# EAGLE design MAX30101_Qwiic_PCB_v6 (EAGLE 9.6.2)
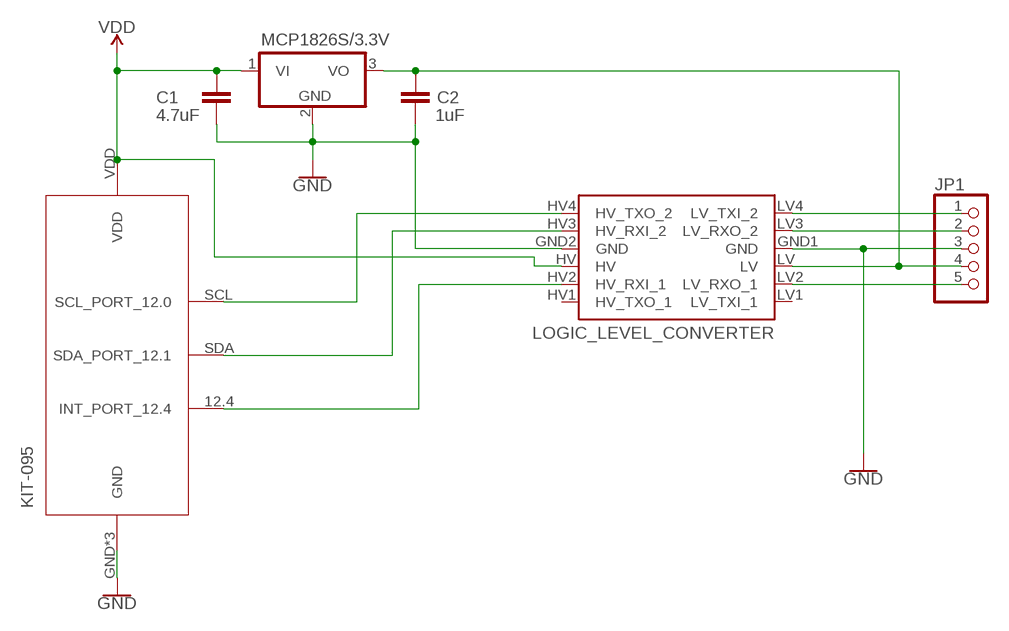
[diagram p0: schematic, sheet 1]

## Parts
C1  4.7uF  0.1UF-KIT-EZ-50V-20%  [CAP-PTH-SMALL-KIT]
C2  1uF  0.1UF-KIT-EZ-50V-20%  [CAP-PTH-SMALL-KIT]
IC1  7805T  [TO220H]
JP1  PINHD-1X5/90  [1X05/90]
KIT-095  KIT-095  [KIT-095]
LOGIC_LEVEL_CONVERTER  SPARKFUN_LOGIC_LEVEL_CONVERTER  [SPARKFUN_LOGIC_LEVEL_CONVERTER]

## Nets
GND [power]: C1.2 C2.2 IC1.2(GND) JP1.3 KIT-095._GND(GND) KIT-095.GND KIT-095.GND_(GND) LOGIC_LEVEL_CONVERTER.GND1(GND) LOGIC_LEVEL_CONVERTER.GND2(GND)
N$1: C2.1 IC1.3(VO) JP1.4 LOGIC_LEVEL_CONVERTER.LV
N$2: KIT-095.SCL(SCL_PORT_12.0) LOGIC_LEVEL_CONVERTER.HV4(HV_TXO_2)
N$4: KIT-095.SDA(SDA_PORT_12.1) LOGIC_LEVEL_CONVERTER.HV3(HV_RXI_2)
N$5: KIT-095.12.4(INT_PORT_12.4) LOGIC_LEVEL_CONVERTER.HV2(HV_RXI_1)
N$6: JP1.1 LOGIC_LEVEL_CONVERTER.LV4(LV_TXI_2)
N$7: JP1.2 LOGIC_LEVEL_CONVERTER.LV3(LV_RXO_2)
N$8: JP1.5 LOGIC_LEVEL_CONVERTER.LV2(LV_RXO_1)
VDD: C1.1 IC1.1(VI) KIT-095.VDD LOGIC_LEVEL_CONVERTER.HV
Unconnected: LOGIC_LEVEL_CONVERTER.HV1(HV_TXO_1) LOGIC_LEVEL_CONVERTER.LV1(LV_TXI_1)

## Notes on the sheet
- MCP1826S/3.3V

## Library data of the parts
C1 C2 = SparkFun-Capacitors:0.1UF: 0.1µF ceramic capacitors A capacitor is a passive two-terminal electrical component used to store electrical energy temporarily in an electric field.; PROD_ID: CAP-08370; VALUE: 0.1uF
IC1 = linear:78*: Positive VOLTAGE REGULATOR Source: http://cache.national.com/ds/LM/LM78L05.pdf http://www.fairchildsemi.com/ds/LM/LM7805.pdf
JP1 = pinhead:PINHD-1X5: PIN HEADER
KIT-095 = Support-Library:KIT-095
LOGIC_LEVEL_CONVERTER = SparkFun-Boards:SPARKFUN_LOGIC_LEVEL_CONVERTER: SparkFun Logic Level Converter -Bi-Directional This is the mechnical outline for the 3.3V - 5V bi directional logic level converter. *Note, the "LOCK" Package has the header pins staggered by an offset of 5 mils (off center line), so that when you slide a row of standard 0.1" headers into the PTH pads, it will hold position vertically. See the follwing turorial for more information on this type of special footprints: Sneaky Footprints <https://www.sparkfun.com/tutorials/114> SparkFun Products: SparkFun Logic Level Converter - Bi-Directional <https://www.sparkfun.com/products/12009>

## Net classes
0 default: width 1 mm, drill 0.8 mm, clearance 0.6 mm
1 power: width 1 mm, drill 0.8 mm, clearance 0.205 mm to class 0, clearance 0.6 mm

## Board
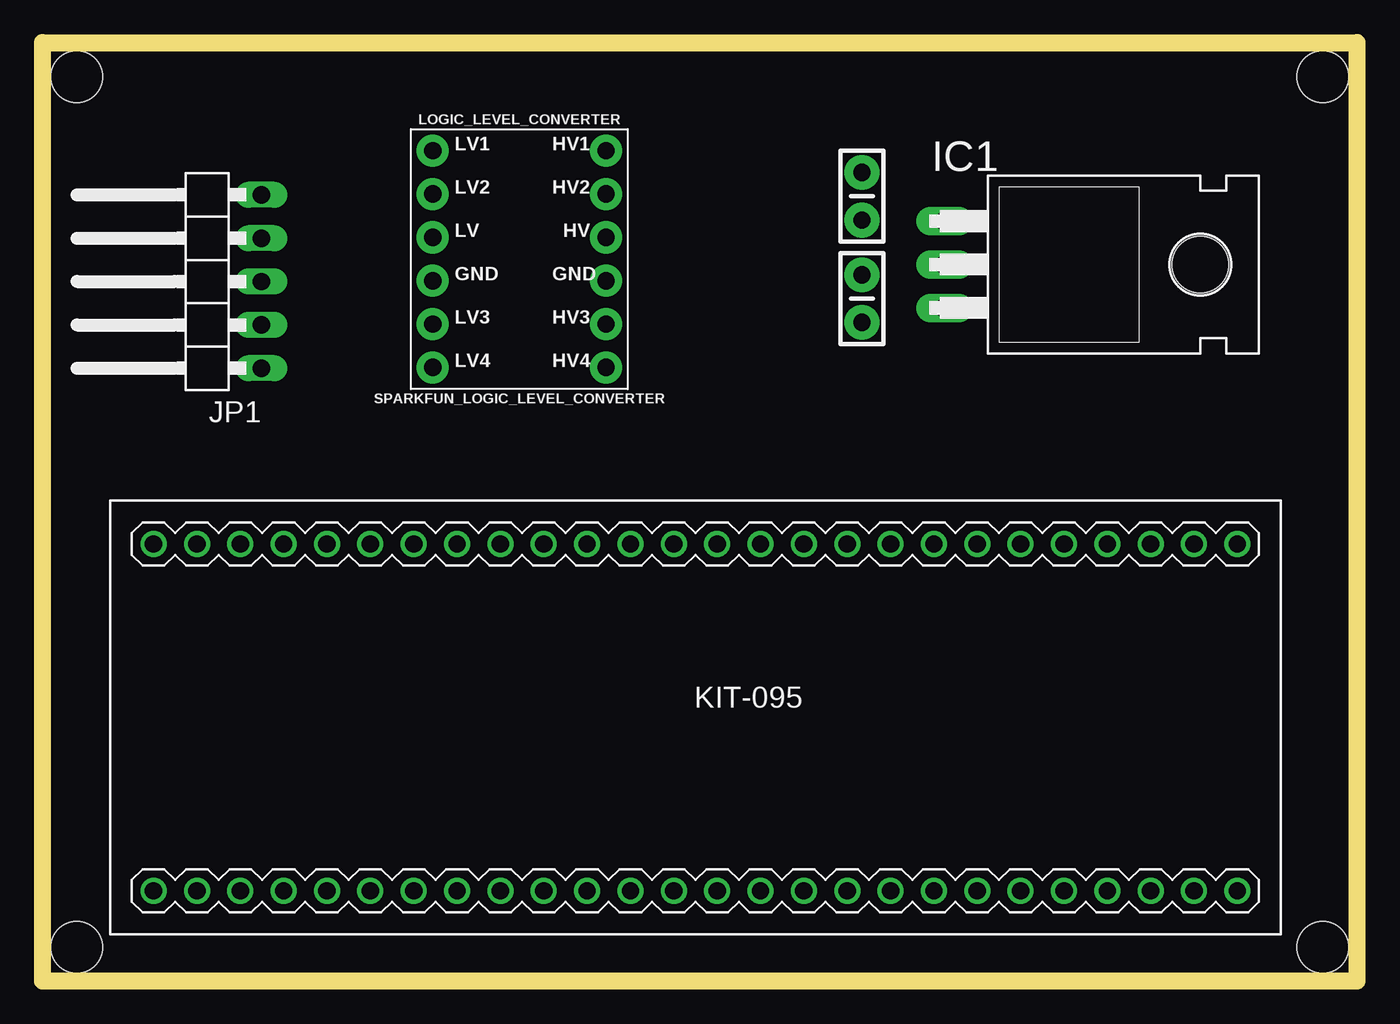
[diagram p1: board, top side]
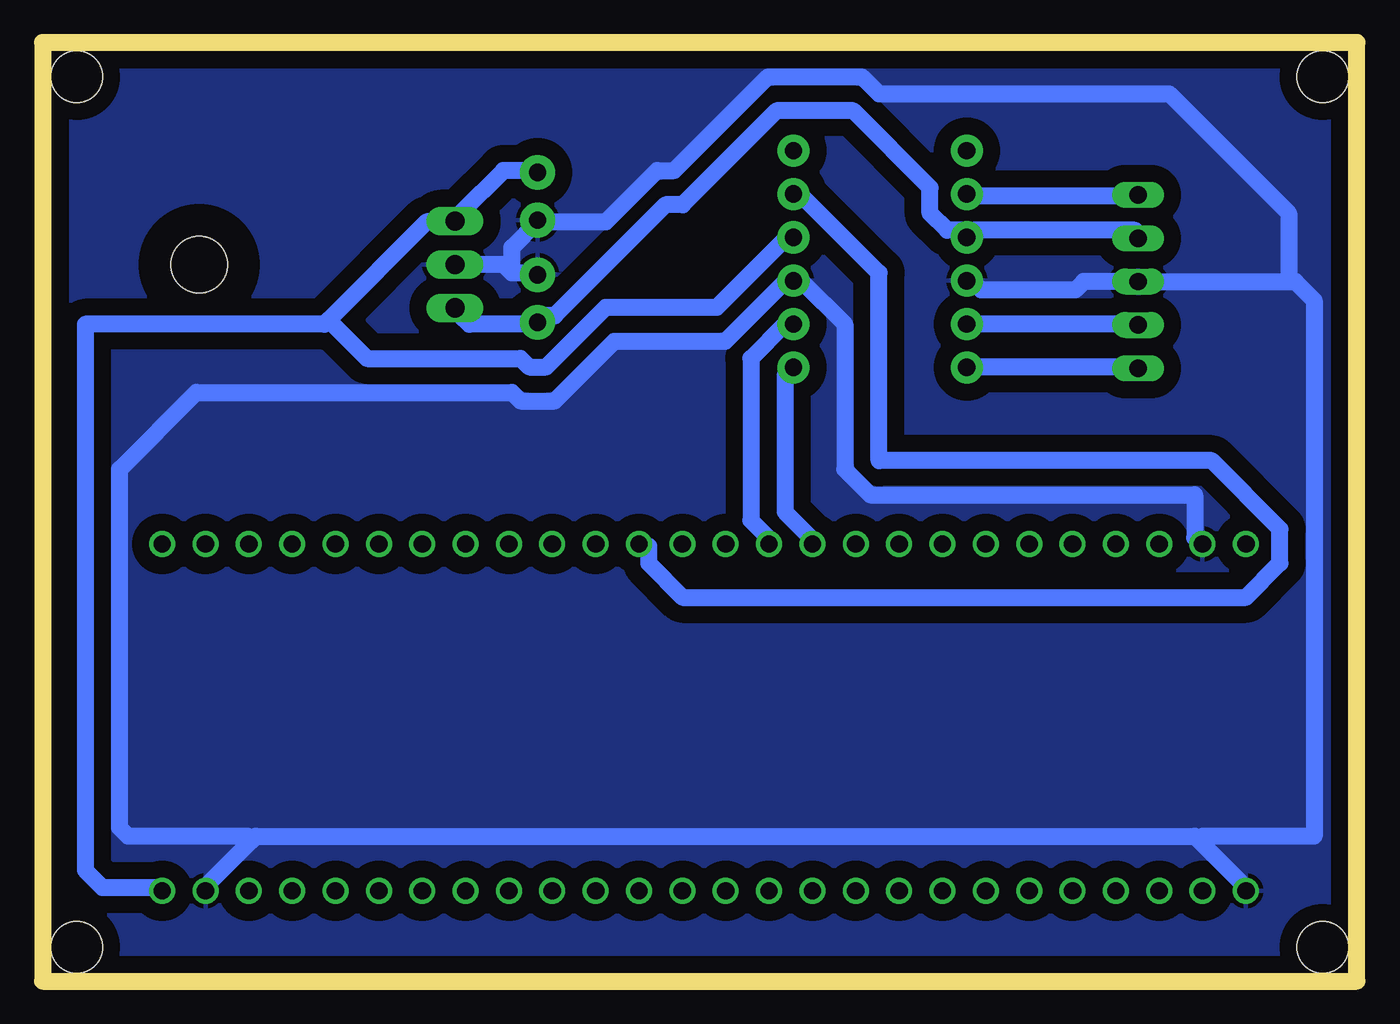
[diagram p2: board, bottom side, seen from below]

Size 77 x 55 mm. Coordinates in mm from the lower left corner, seen from the top.
Outline: 0,0 0,55 77,55 77,0 0,0
Copper layers (1*16): Top 0.035mm / dielectric 1.5mm / Bottom 0.035mm
Design rules "SparkFun-2-layer-TIGHT": minimum track width 7mil, minimum drill 15mil, track to track 7mil, track to pad 7mil, pad to pad 7mil, via to via 7mil, smd to smd 7mil, copper to edge 7mil, drill to drill 7mil, minimum pad ring 7mil, minimum via ring 7mil, stop-mask expansion 4mil, vias tented up to drill 25mil, thermal gap 10mil
Holes 3 mm at 2,53 2,2 75,2 75,53

### Footprints (pad centres in the part's own frame; a part is rotated, then mirrored left to right if it is on the bottom)
CAP-PTH-SMALL-KIT = drill 1.016 pad 2.032: 1 -1.397,0; 2 1.397,0
TO220H = drill 1.118 long: 1 -2.54,-10.16; 2 0,-10.16; 3 2.54,-10.16 | hole 3.302: 0,4.826
1X05/90 = drill 1.016 long: 1 -5.08,-3.81; 2 -2.54,-3.81; 3 0,-3.81; 4 2.54,-3.81; 5 5.08,-3.81
KIT-095 = drill 1.016: 0.0 7.62,0; 0.1 10.16,0; 0.2 12.7,0; 0.3 15.24,0; 0.4 17.78,0; 0.5 20.32,0; 0.6 22.86,0; 0.7 25.4,0; 1.0 -7.62,20.32; 1.1 -10.16,20.32; 1.2 -12.7,20.32; 1.3 -15.24,20.32; 1.4 -17.78,20.32; 1.5 -20.32,20.32; 1.6 -22.86,20.32; 1.7 -25.4,20.32; 2.0 33.02,20.32; 2.1 30.48,20.32; 2.2 27.94,20.32; 2.3 25.4,20.32; 2.4 22.86,20.32; 2.5 20.32,20.32; 2.6 17.78,20.32; 2.7 15.24,20.32; 3.0 -27.94,0; 3.1 -25.4,0; 3.2 -22.86,0; 3.3 -20.32,0; 3.4 -17.78,0; 3.5 -15.24,0; 3.6 -12.7,0; 3.7 -10.16,0; 12.2 0,20.32; 12.3 2.54,20.32; 12.4 5.08,20.32; 12.5 7.62,20.32; 15.0 -7.62,0; 15.1 -5.08,0; 15.2 -2.54,0; 15.3 0,0; 15.4 2.54,0; 15.5 5.08,0; _GND -30.48,0; GND -27.94,20.32; GND_ 30.48,0; RST 27.94,0; RX 10.16,20.32; SCL -5.08,20.32; SDA -2.54,20.32; TX 12.7,20.32; VDD 33.02,0; VDDIO -30.48,20.32
SPARKFUN_LOGIC_LEVEL_CONVERTER = drill 1.016 pad 1.88: GND1 -5.08,-1.27; GND2 5.08,-1.27; HV 5.08,1.27; HV1 5.08,6.35; HV2 5.08,3.81; HV3 5.08,-3.81; HV4 5.08,-6.35; LV -5.08,1.27; LV1 -5.08,6.35; LV2 -5.08,3.81; LV3 -5.08,-3.81; LV4 -5.08,-6.35

### Placement (x,y rotation side)
C1  48,46 270 top
C2  48,40 90 top
IC1  63,42 270 top
JP1  9,41 90 top
KIT-095  36.98,5.3 0 top
LOGIC_LEVEL_CONVERTER  27.93,42.32 0 top

### Tracks (layer width: path | path; a pad name or v marks a point on that pad's centre or on a via)
GND
  Bottom 1: LOGIC_LEVEL_CONVERTER.GND1 22.5,41 22,40.5 16.5,40.5 16,41 JP1.3 4,41 | IC1.2 50,42 49.75,41.75 | 49.75,41.75 49.5,41.5 48,41.5 C2.2 | 48,44.5 49.5,43 49.5,42 49.75,41.75 | 48,44.5 44,44.5 41,47.5 40,47.5 34.5,53 29,53 28,52 11,52 4,45 4,41 | 48,44.5 C1.2 | KIT-095.GND 9.5,26 9.5,28.5 28.5,28.5 30,30 30,38.5 32.5,41 33,41 LOGIC_LEVEL_CONVERTER.GND2 33.5,41 37,37.5 43.5,37.5 47,34 49,34 49.5,34.5 68,34.5 72.5,30 72.5,9 72,8.5 65,8.5 64.75,8.25 | 9.25,8.25 9.5,8.5 64.5,8.5 64.75,8.25 | 9.25,8.25 6.5,5.5 KIT-095._GND | 64.75,8.25 67.5,5.5 KIT-095.GND_ | 9.25,8.25 9,8.5 2.5,8.5 2.5,39.9 3.6,41 4,41
  pour Bottom (isolate 1): 1,54 1,1 76,1 76,54
N$1
  Bottom 1: IC1.3 52.5,39 52,38.5 48,38.5 C2.1 48,39 47,39 40.5,45.5 39.5,45.5 34,51 29.5,51 25,46.5 25,45 24,44 23,44 LOGIC_LEVEL_CONVERTER.LV 22.5,44 13,44 JP1.4
N$2
  Bottom 1: KIT-095.SCL 32,26 33.5,27.5 33.5,35.5 LOGIC_LEVEL_CONVERTER.HV4
N$4
  Bottom 1: KIT-095.SDA 34.5,26 35.5,27 35.5,36.5 33.5,38.5 LOGIC_LEVEL_CONVERTER.HV3
N$5
  Bottom 1: LOGIC_LEVEL_CONVERTER.HV2 33,46 32.5,46 28,41.5 28,30.5 8.5,30.5 4.5,26.5 4.5,24.5 6.5,22.5 39.5,22.5 41.5,24.5 41.5,25.5 42,25.5 KIT-095.12.4
N$6
  Bottom 1: LOGIC_LEVEL_CONVERTER.LV4 22.5,36 13,36 JP1.1
N$7
  Bottom 1: LOGIC_LEVEL_CONVERTER.LV3 22.5,38.5 13,38.5 JP1.2
N$8
  Bottom 1: LOGIC_LEVEL_CONVERTER.LV2 22.5,46 13,46 JP1.5
VDD
  Bottom 1: C1.1 48,47.5 50,47.5 52.5,45 IC1.1 53,44.5 54.5,44.5 60.25,38.75 | 60.25,38.75 60.5,38.5 74.5,38.5 74.5,6.5 73.5,5.5 70,5.5 KIT-095.VDD | 60.25,38.75 58,36.5 49,36.5 48.5,36 47.5,36 44,39.5 37.5,39.5 33.5,43.5 LOGIC_LEVEL_CONVERTER.HV